# EAGLE schematic untitled (EAGLE 6.1)
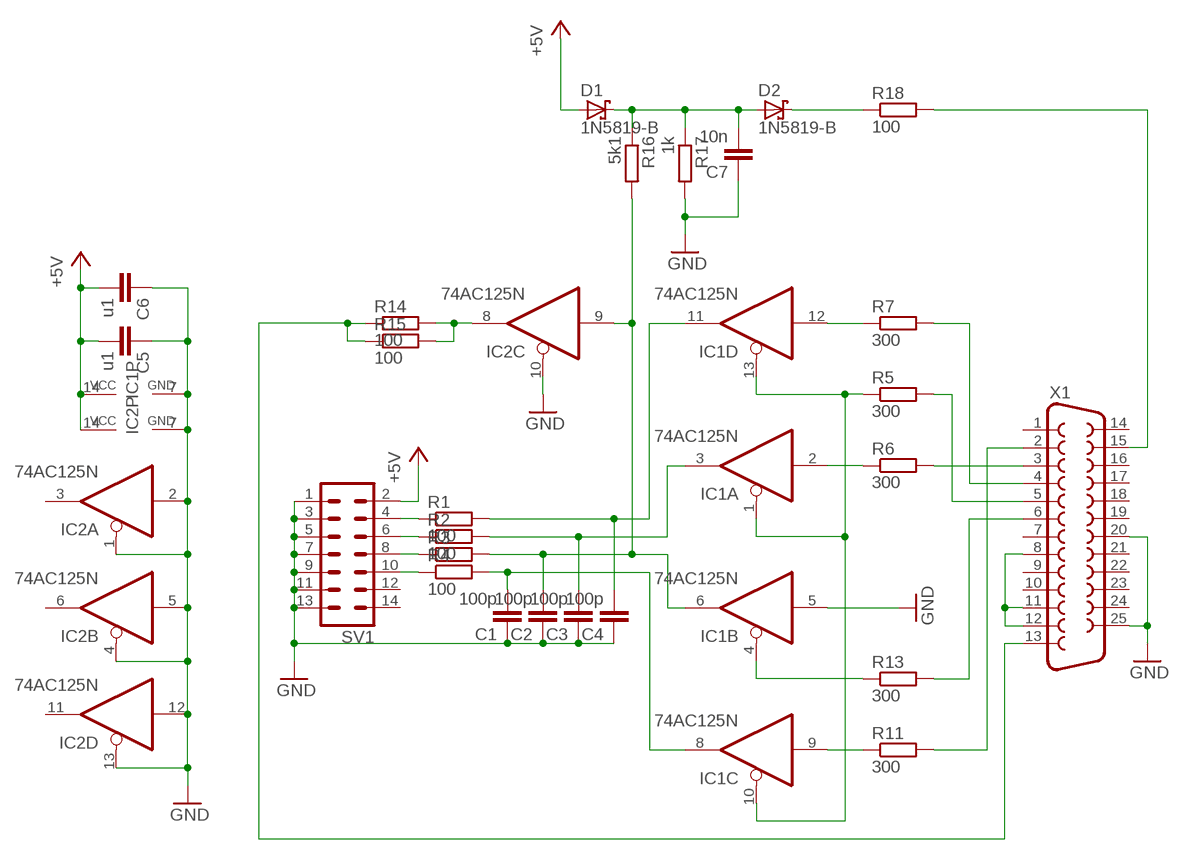
[diagram p0: schematic, sheet 1]

## Parts
C1  100p  C-EU025-025X050  [C025-025X050]
C2  100p  C-EU025-025X050  [C025-025X050]
C3  100p  C-EU025-025X050  [C025-025X050]
C4  100p  C-EU025-025X050  [C025-025X050]
C5  u1  C-EU025-025X050  [C025-025X050]
C6  u1  C-EU025-025X050  [C025-025X050]
C7  10n  C-EU025-025X050  [C025-025X050]
D1  1N5819-B  [DO41-7.6]
D2  1N5819-B  [DO41-7.6]
IC1  74AC125N  [DIL14]
IC2  74AC125N  [DIL14]
R1  100  R-EU_0207/2V  [0207/2V]
R2  100  R-EU_0207/2V  [0207/2V]
R3  R-EU_0207/2V  [0207/2V]
R4  100  R-EU_0207/2V  [0207/2V]
R5  300  R-EU_0207/7  [0207/7]
R6  300  R-EU_0207/7  [0207/7]
R7  300  R-EU_0207/7  [0207/7]
R11  300  R-EU_0207/12  [0207/12]
R13  300  R-EU_0207/7  [0207/7]
R14  100  R-EU_0207/7  [0207/7]
R15  100  R-EU_0207/7  [0207/7]
R16  5k1  R-EU_0309/12  [0309/12]
R17  1k  R-EU_0207/7  [0207/7]
R18  100  R-EU_0207/2V  [0207/2V]
SV1  ML14  [ML14]
X1  F25HP  [F25HP]

## Nets
+5V: C5.2 C6.2 D1.A IC1.14(P:VCC) IC2.14(P:VCC) SV1.2
GND: C1.1 C2.1 C3.1 C4.1 C5.1 C6.1 C7.1 IC1.5(B:I) IC1.7(P:GND) IC2.1(A:OE) IC2.2(A:I) IC2.4(B:OE) IC2.5(B:I) IC2.7(P:GND) IC2.10(C:OE) IC2.12(D:I) IC2.13(D:OE) R17.2 SV1.1 SV1.3 SV1.5 SV1.7 SV1.9 SV1.11 SV1.13 X1.20 X1.25
N$1: C1.2 IC1.8(C:O) R4.2
N$2: R1.1 SV1.4
N$3: R2.1 SV1.6
N$4: R3.1 SV1.8
N$5: R4.1 SV1.10
N$6: C2.2 IC1.6(B:O) IC2.9(C:I) R3.2 R16.2
N$7: C3.2 IC1.3(A:O) R2.2
N$8: C4.2 IC1.11(D:O) R1.2
N$9: IC1.1(A:OE) IC1.10(C:OE) IC1.13(D:OE) R5.1
N$10: IC1.12(D:I) R7.1
N$11: IC1.9(C:I) R11.1
N$12: IC1.4(B:OE) R13.1
N$13: IC1.2(A:I) R6.1
N$14: IC2.8(C:O) R14.2 R15.2
N$15: R14.1 R15.1 X1.13
N$16: C7.2 D1.C D2.A R16.1 R17.1
N$18: D2.C R18.1
N$19: R18.2 X1.15
N$20: R7.2 X1.4
N$21: R5.2 X1.5
N$22: R6.2 X1.3
N$23: R13.2 X1.6
N$24: R11.2 X1.2
N$26: X1.8 X1.11 X1.12
Unconnected: IC2.3(A:O) IC2.6(B:O) IC2.11(D:O) SV1.12 SV1.14 X1.1 X1.7 X1.9 X1.10 X1.14 X1.16 X1.17 X1.18 X1.19 X1.21 X1.22 X1.23 X1.24

## Library data of the parts
C1-C7 = rcl:C-EU: CAPACITOR, European symbol
D1 D2 = diode:1N581*: 1.0A SCHOTTKY BARRIER RECTIFIER Source: http://www.diodes.com/datasheets/ds23001.pdf
IC1 IC2 = 74xx-eu:74*125: Quad bus BUFFER, 3-state
R1-R7 R11 R13-R18 = rcl:R-EU_: RESISTOR, European symbol
SV1 = con-harting-ml:ML14: HARTING; OC_FARNELL: unknown; OC_NEWARK: unknown
X1 = con-subd:F25: SUB-D; OC_FARNELL: unknown; OC_NEWARK: unknown